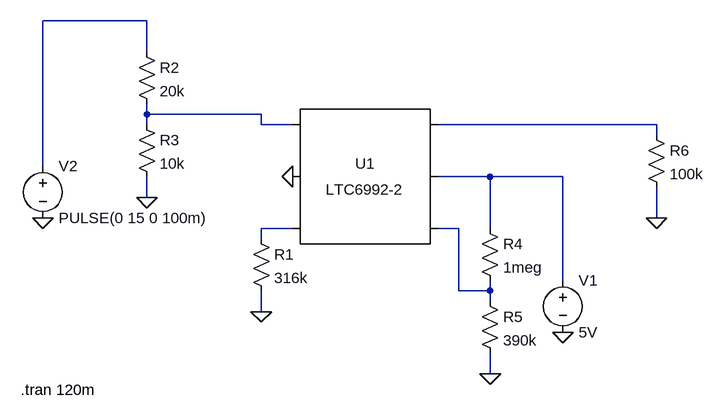
[diagram p0: schematic LTC6992-2_AFB_v3_vBat.asc]
LTC6992-2_AFB_v3_vBat.asc, the LTspice schematic file:
Version 4
SHEET 1 880 680
WIRE -160 -128 -320 -128
WIRE -160 -80 -160 -128
WIRE -160 16 -160 0
WIRE 16 16 -160 16
WIRE -160 32 -160 16
WIRE 16 32 16 16
WIRE 64 32 16 32
WIRE 624 32 288 32
WIRE 624 48 624 32
WIRE -320 96 -320 -128
WIRE 368 112 288 112
WIRE 480 112 368 112
WIRE -160 144 -160 112
WIRE 624 176 624 128
WIRE 64 192 16 192
WIRE 320 192 288 192
WIRE 368 192 368 112
WIRE 16 208 16 192
WIRE 480 272 480 112
WIRE 320 288 320 192
WIRE 368 288 368 272
WIRE 368 288 320 288
WIRE 368 304 368 288
WIRE 16 320 16 288
WIRE 368 416 368 384
FLAG 480 352 0
FLAG 16 320 0
FLAG 64 112 0
FLAG -320 176 0
FLAG -160 144 0
FLAG 368 416 0
FLAG 624 176 0
SYMBOL SpecialFunctions\\LTC6992-2 176 112 R0
SYMATTR InstName U1
SYMBOL voltage 480 256 R0
WINDOW 123 0 0 Left 2
WINDOW 39 0 0 Left 2
SYMATTR InstName V1
SYMATTR Value 5V
SYMBOL res 0 192 R0
SYMATTR InstName R1
SYMATTR Value 316k
SYMBOL voltage -320 80 R0
WINDOW 123 0 0 Left 2
WINDOW 39 0 0 Left 2
SYMATTR InstName V2
SYMATTR Value PULSE(0 15 0 100m)
SYMBOL res -176 -96 R0
SYMATTR InstName R2
SYMATTR Value 20k
SYMBOL res -176 16 R0
SYMATTR InstName R3
SYMATTR Value 10k
SYMBOL res 352 176 R0
SYMATTR InstName R4
SYMATTR Value 1meg
SYMBOL res 352 288 R0
SYMATTR InstName R5
SYMATTR Value 390k
SYMBOL res 608 32 R0
SYMATTR InstName R6
SYMATTR Value 100k
TEXT -354 440 Left 2 !.tran 120m

The netlist it stands for:
* LTC6992-2_AFB_v3_vBat.asc
XU1 N002 0 N005 N006 N004 N003 LTC6992-2
V1 N004 0 5V
R1 N005 0 316k
V2 N001 0 PULSE(0 15 0 100m)
R2 N001 N002 20k
R3 N002 0 10k
R4 N004 N006 1meg
R5 N006 0 390k
R6 N003 0 100k
.tran 120m
.lib LTC6992-2.sub
.backanno
.end